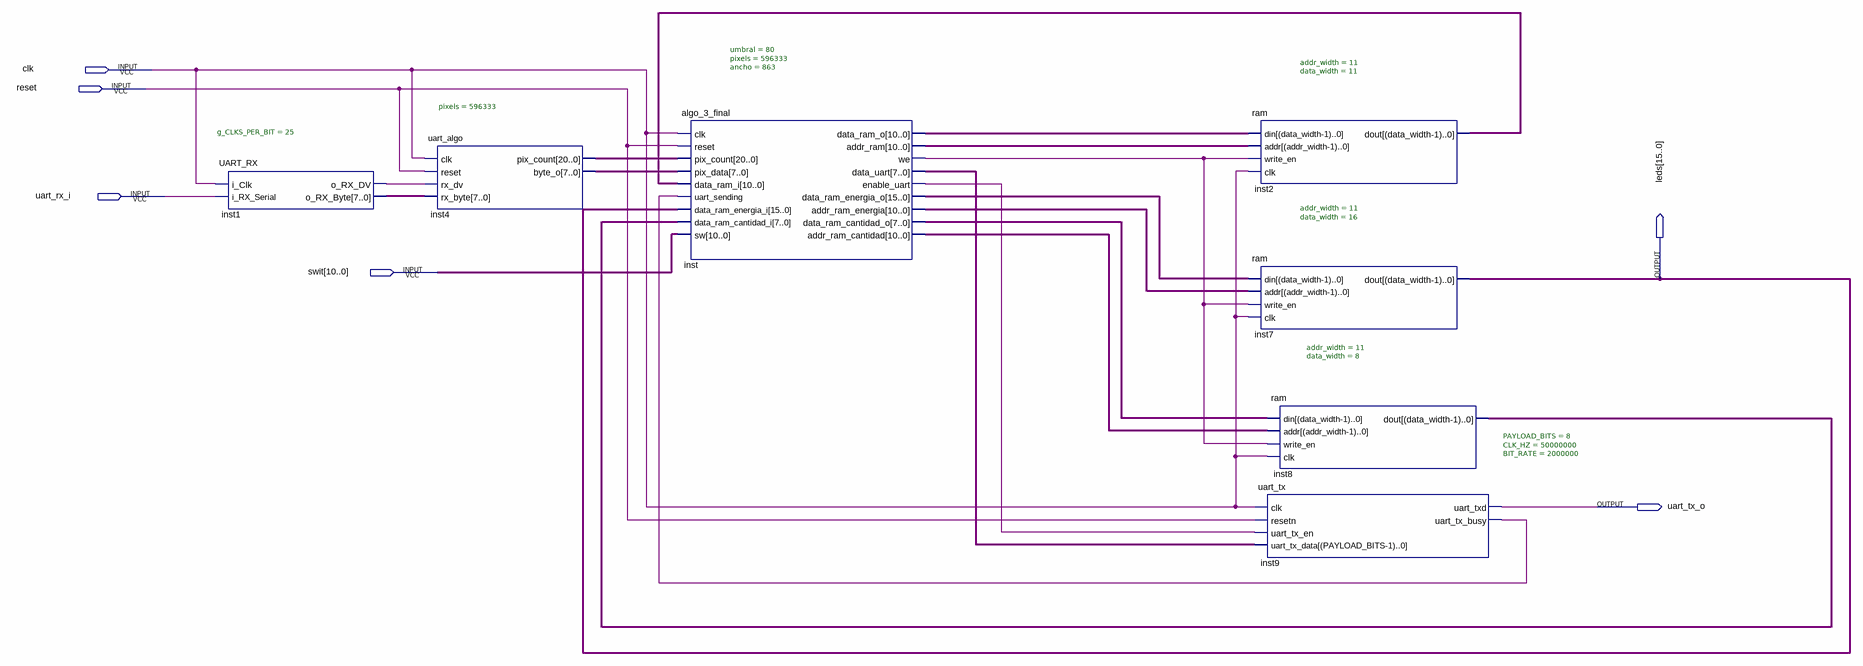
[diagram p0: schematic sheet]
// Quartus schematic anda_plis_2.bdf as structural Verilog: 7 symbols, 6 pins
module anda_plis_2 (
  input  clk,
  input  reset,
  input  uart_rx_i,
  input  [10:0] swit,
  output [15:0] leds,
  output uart_tx_o
);

  wire inst1_o_rx_dv, inst9_uart_tx_busy, inst_enable_uart, inst_we;
  wire [7:0] inst1_o_rx_byte, inst4_byte_o, inst8_dout, inst_data_ram_cantidad_o, inst_data_uart;
  wire [10:0] inst2_dout, inst_addr_ram, inst_addr_ram_cantidad, inst_addr_ram_energia, inst_data_ram_o;
  wire [15:0] inst_data_ram_energia_o;
  wire [20:0] inst4_pix_count;

  UART_RX #(.g_CLKS_PER_BIT(25)) inst1 (
    .i_Clk(clk), .i_RX_Serial(uart_rx_i), .o_RX_DV(inst1_o_rx_dv), .o_RX_Byte(inst1_o_rx_byte));
  uart_algo #(.pixels(596333)) inst4 (
    .clk(clk), .reset(reset), .rx_dv(inst1_o_rx_dv), .rx_byte(inst1_o_rx_byte), .pix_count(inst4_pix_count),
    .byte_o(inst4_byte_o));
  algo_3_final #(.umbral(80), .pixels(596333), .ancho(863)) inst (
    .clk(clk), .reset(reset), .pix_count(inst4_pix_count), .pix_data(inst4_byte_o), .data_ram_i(inst2_dout),
    .uart_sending(inst9_uart_tx_busy), .data_ram_energia_i(leds), .data_ram_cantidad_i(inst8_dout),
    .sw(swit), .data_ram_o(inst_data_ram_o), .addr_ram(inst_addr_ram), .we(inst_we),
    .data_uart(inst_data_uart), .enable_uart(inst_enable_uart), .data_ram_energia_o(inst_data_ram_energia_o),
    .addr_ram_energia(inst_addr_ram_energia), .data_ram_cantidad_o(inst_data_ram_cantidad_o),
    .addr_ram_cantidad(inst_addr_ram_cantidad));
  ram #(.addr_width(11), .data_width(11)) inst2 (
    .din(inst_data_ram_o), .addr(inst_addr_ram), .write_en(inst_we), .clk(clk), .dout(inst2_dout));
  ram #(.addr_width(11), .data_width(16)) inst7 (
    .din(inst_data_ram_energia_o), .addr(inst_addr_ram_energia), .write_en(inst_we), .clk(clk), .dout(leds));
  ram #(.addr_width(11), .data_width(8)) inst8 (
    .din(inst_data_ram_cantidad_o), .addr(inst_addr_ram_cantidad), .write_en(inst_we), .clk(clk),
    .dout(inst8_dout));
  uart_tx #(.PAYLOAD_BITS(8), .CLK_HZ(50000000), .BIT_RATE(2000000)) inst9 (
    .clk(clk), .resetn(reset), .uart_tx_en(inst_enable_uart), .uart_tx_data(inst_data_uart),
    .uart_txd(uart_tx_o), .uart_tx_busy(inst9_uart_tx_busy));
endmodule
